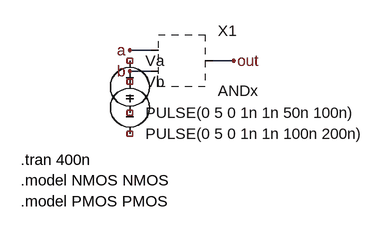
[diagram p0: schematic ANDx_test.asc]
ANDx_test.asc, the LTspice schematic file:
Version 4
.lib "../simulation_build/ModelSp2025.txt"
.include "NAND.asc"
.include "INVERT.asc"
SHEET 1 880 680
WIRE 176 128 144 128
WIRE 176 160 144 160
WIRE 304 144 272 144
FLAG 304 144 out
FLAG 144 128 a
FLAG 144 160 b
SYMBOL ANDx 224 144 R0
SYMATTR InstName X1
SYMBOL voltage 144 128 R0
WINDOW 123 0 0 Left 0
WINDOW 39 0 0 Left 0
SYMATTR InstName Va
SYMATTR Value PULSE(0 5 0 1n 1n 50n 100n)
SYMBOL voltage 144 160 R0
WINDOW 123 0 0 Left 0
WINDOW 39 0 0 Left 0
SYMATTR InstName Vb
SYMATTR Value PULSE(0 5 0 1n 1n 100n 200n)
TEXT -24 296 Left 2 !.tran 400n
TEXT -24 328 Left 2 !.model NMOS NMOS
TEXT -24 360 Left 2 !.model PMOS PMOS

The netlist it stands for:
* ANDx_test.asc
* X1: ANDx (symbol ANDx not available, pin order unknown); nets seen at it: a, b, out
Va NC_01 NC_02 PULSE(0 5 0 1n 1n 50n 100n)
Vb NC_03 NC_04 PULSE(0 5 0 1n 1n 100n 200n)
.tran 400n
.model NMOS NMOS
.model PMOS PMOS
.backanno
.end